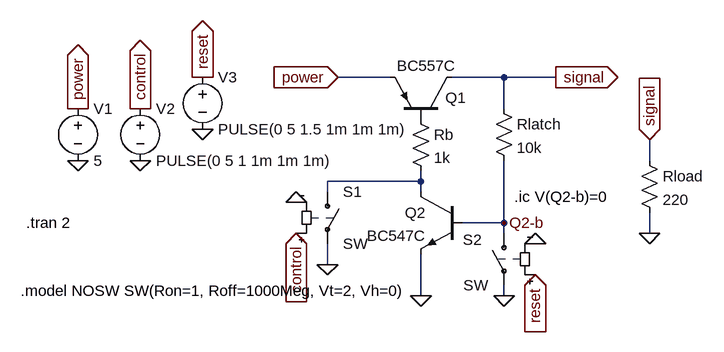
[diagram p0: schematic latch-reset-npn-pnp.asc]
latch-reset-npn-pnp.asc, the LTspice schematic file:
Version 4
SHEET 1 1184 680
WIRE 464 112 384 112
WIRE 640 112 560 112
WIRE 720 112 640 112
WIRE 640 160 640 112
WIRE 864 240 864 208
WIRE 512 272 512 256
WIRE 512 272 368 272
WIRE 368 288 368 272
WIRE 512 288 512 272
WIRE 640 336 640 240
WIRE 640 336 576 336
WIRE 640 352 640 336
WIRE 864 352 864 320
WIRE 368 400 368 368
WIRE 512 448 512 384
WIRE 640 448 640 432
FLAG 512 448 0
FLAG 384 112 power
IOPIN 384 112 In
FLAG 720 112 signal
IOPIN 720 112 Out
FLAG 864 352 0
FLAG 864 208 signal
IOPIN 864 208 In
FLAG -16 240 0
FLAG -16 160 power
IOPIN -16 160 Out
FLAG 80 240 0
FLAG 80 160 control
IOPIN 80 160 Out
FLAG 320 352 control
IOPIN 320 352 In
FLAG 320 304 0
FLAG 640 336 Q2-b
FLAG 368 400 0
FLAG 688 368 0
FLAG 688 416 reset
IOPIN 688 416 In
FLAG 640 448 0
FLAG 176 192 0
FLAG 176 112 reset
IOPIN 176 112 Out
SYMBOL pnp 560 176 M270
WINDOW 0 33 10 VLeft 2
WINDOW 3 82 85 VLeft 2
SYMATTR InstName Q1
SYMATTR Value BC557C
SYMBOL npn 576 288 M0
SYMATTR InstName Q2
SYMATTR Value BC547C
SYMBOL Res 624 144 R0
SYMATTR InstName Rlatch
SYMATTR Value 10k
SYMBOL Res 848 224 R0
SYMATTR InstName Rload
SYMATTR Value 220
SYMBOL Voltage -16 144 R0
SYMATTR InstName V1
SYMATTR Value 5
SYMBOL Voltage 80 144 R0
SYMATTR InstName V2
SYMATTR Value PULSE(0 5 1 1m 1m 1m)
SYMBOL sw 368 272 R0
SYMATTR InstName S1
SYMATTR SpiceModel NOSW
SYMBOL Res 496 160 R0
SYMATTR InstName Rb
SYMATTR Value 1k
SYMBOL sw 640 336 M0
WINDOW 0 34 26 Left 2
SYMATTR InstName S2
SYMATTR SpiceModel NOSW
SYMBOL Voltage 176 96 R0
SYMATTR InstName V3
SYMATTR Value PULSE(0 5 1.5 1m 1m 1m)
TEXT -104 440 Left 2 !.model NOSW SW(Ron=1, Roff=1000Meg, Vt=2, Vh=0)
TEXT -96 336 Left 2 !.tran 2
TEXT 656 296 Left 2 !.ic V(Q2-b)=0

The netlist it stands for:
* latch-reset-npn-pnp.asc
Q1 signal P001 power 0 BC557C
Q2 N001 Q2-b 0 0 BC547C
Rlatch signal Q2-b 10k
Rload signal 0 220
V1 power 0 5
V2 control 0 PULSE(0 5 1 1m 1m 1m)
S1 N001 0 control 0 NOSW SW
Rb P001 N001 1k
S2 Q2-b 0 reset 0 NOSW SW
V3 reset 0 PULSE(0 5 1.5 1m 1m 1m)
.model NPN NPN
.model PNP PNP
.lib standard.bjt
.model NOSW SW(Ron=1, Roff=1000Meg, Vt=2, Vh=0)
.tran 2
.ic V(Q2-b)=0
.backanno
.end